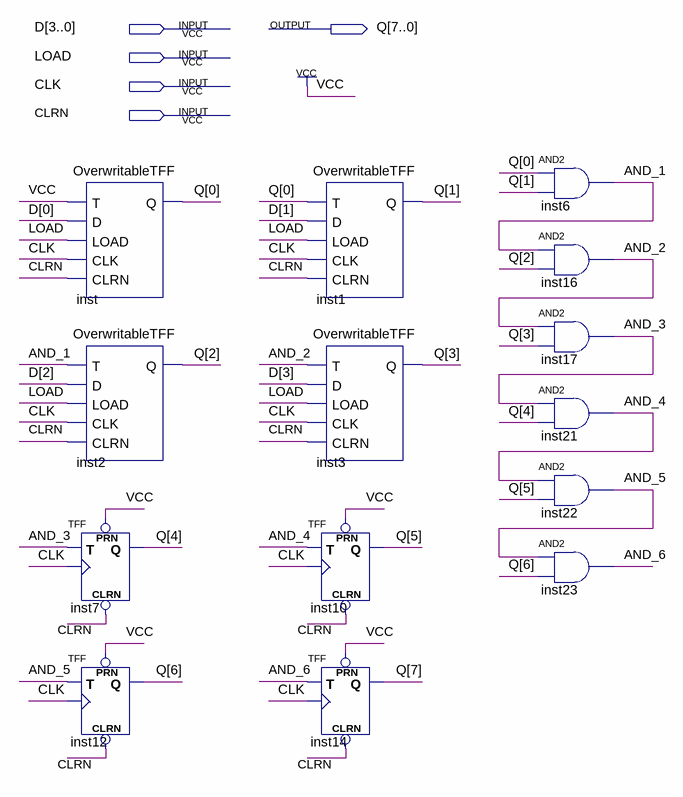
[diagram p0: schematic sheet]
// Quartus schematic SynchronousCounter.bdf as structural Verilog: 14 symbols, 5 pins
module SynchronousCounter (
  input  [3:0] D,
  input  LOAD,
  input  CLK,
  input  CLRN,
  output [7:0] Q
);

  wire AND_1, AND_2, AND_3, AND_4, AND_5, AND_6;

  OverwritableTFF inst (.T(1'b1), .D(D[0]), .LOAD(LOAD), .CLK(CLK), .CLRN(CLRN), .Q(Q[0]));
  OverwritableTFF inst2 (.T(AND_1), .D(D[2]), .LOAD(LOAD), .CLK(CLK), .CLRN(CLRN), .Q(Q[2]));
  TFF inst7 (.PRN(1'b1), .CLRN(CLRN), .T(AND_3), .CLK(CLK), .Q(Q[4]));
  TFF inst12 (.PRN(1'b1), .CLRN(CLRN), .T(AND_5), .CLK(CLK), .Q(Q[6]));
  OverwritableTFF inst1 (.T(Q[0]), .D(D[1]), .LOAD(LOAD), .CLK(CLK), .CLRN(CLRN), .Q(Q[1]));
  OverwritableTFF inst3 (.T(AND_2), .D(D[3]), .LOAD(LOAD), .CLK(CLK), .CLRN(CLRN), .Q(Q[3]));
  TFF inst10 (.PRN(1'b1), .CLRN(CLRN), .T(AND_4), .CLK(CLK), .Q(Q[5]));
  TFF inst14 (.PRN(1'b1), .CLRN(CLRN), .T(AND_6), .CLK(CLK), .Q(Q[7]));
  and inst6 (AND_1, Q[0], Q[1]);
  and inst16 (AND_2, AND_1, Q[2]);
  and inst17 (AND_3, AND_2, Q[3]);
  and inst21 (AND_4, AND_3, Q[4]);
  and inst22 (AND_5, AND_4, Q[5]);
  and inst23 (AND_6, AND_5, Q[6]);
endmodule
